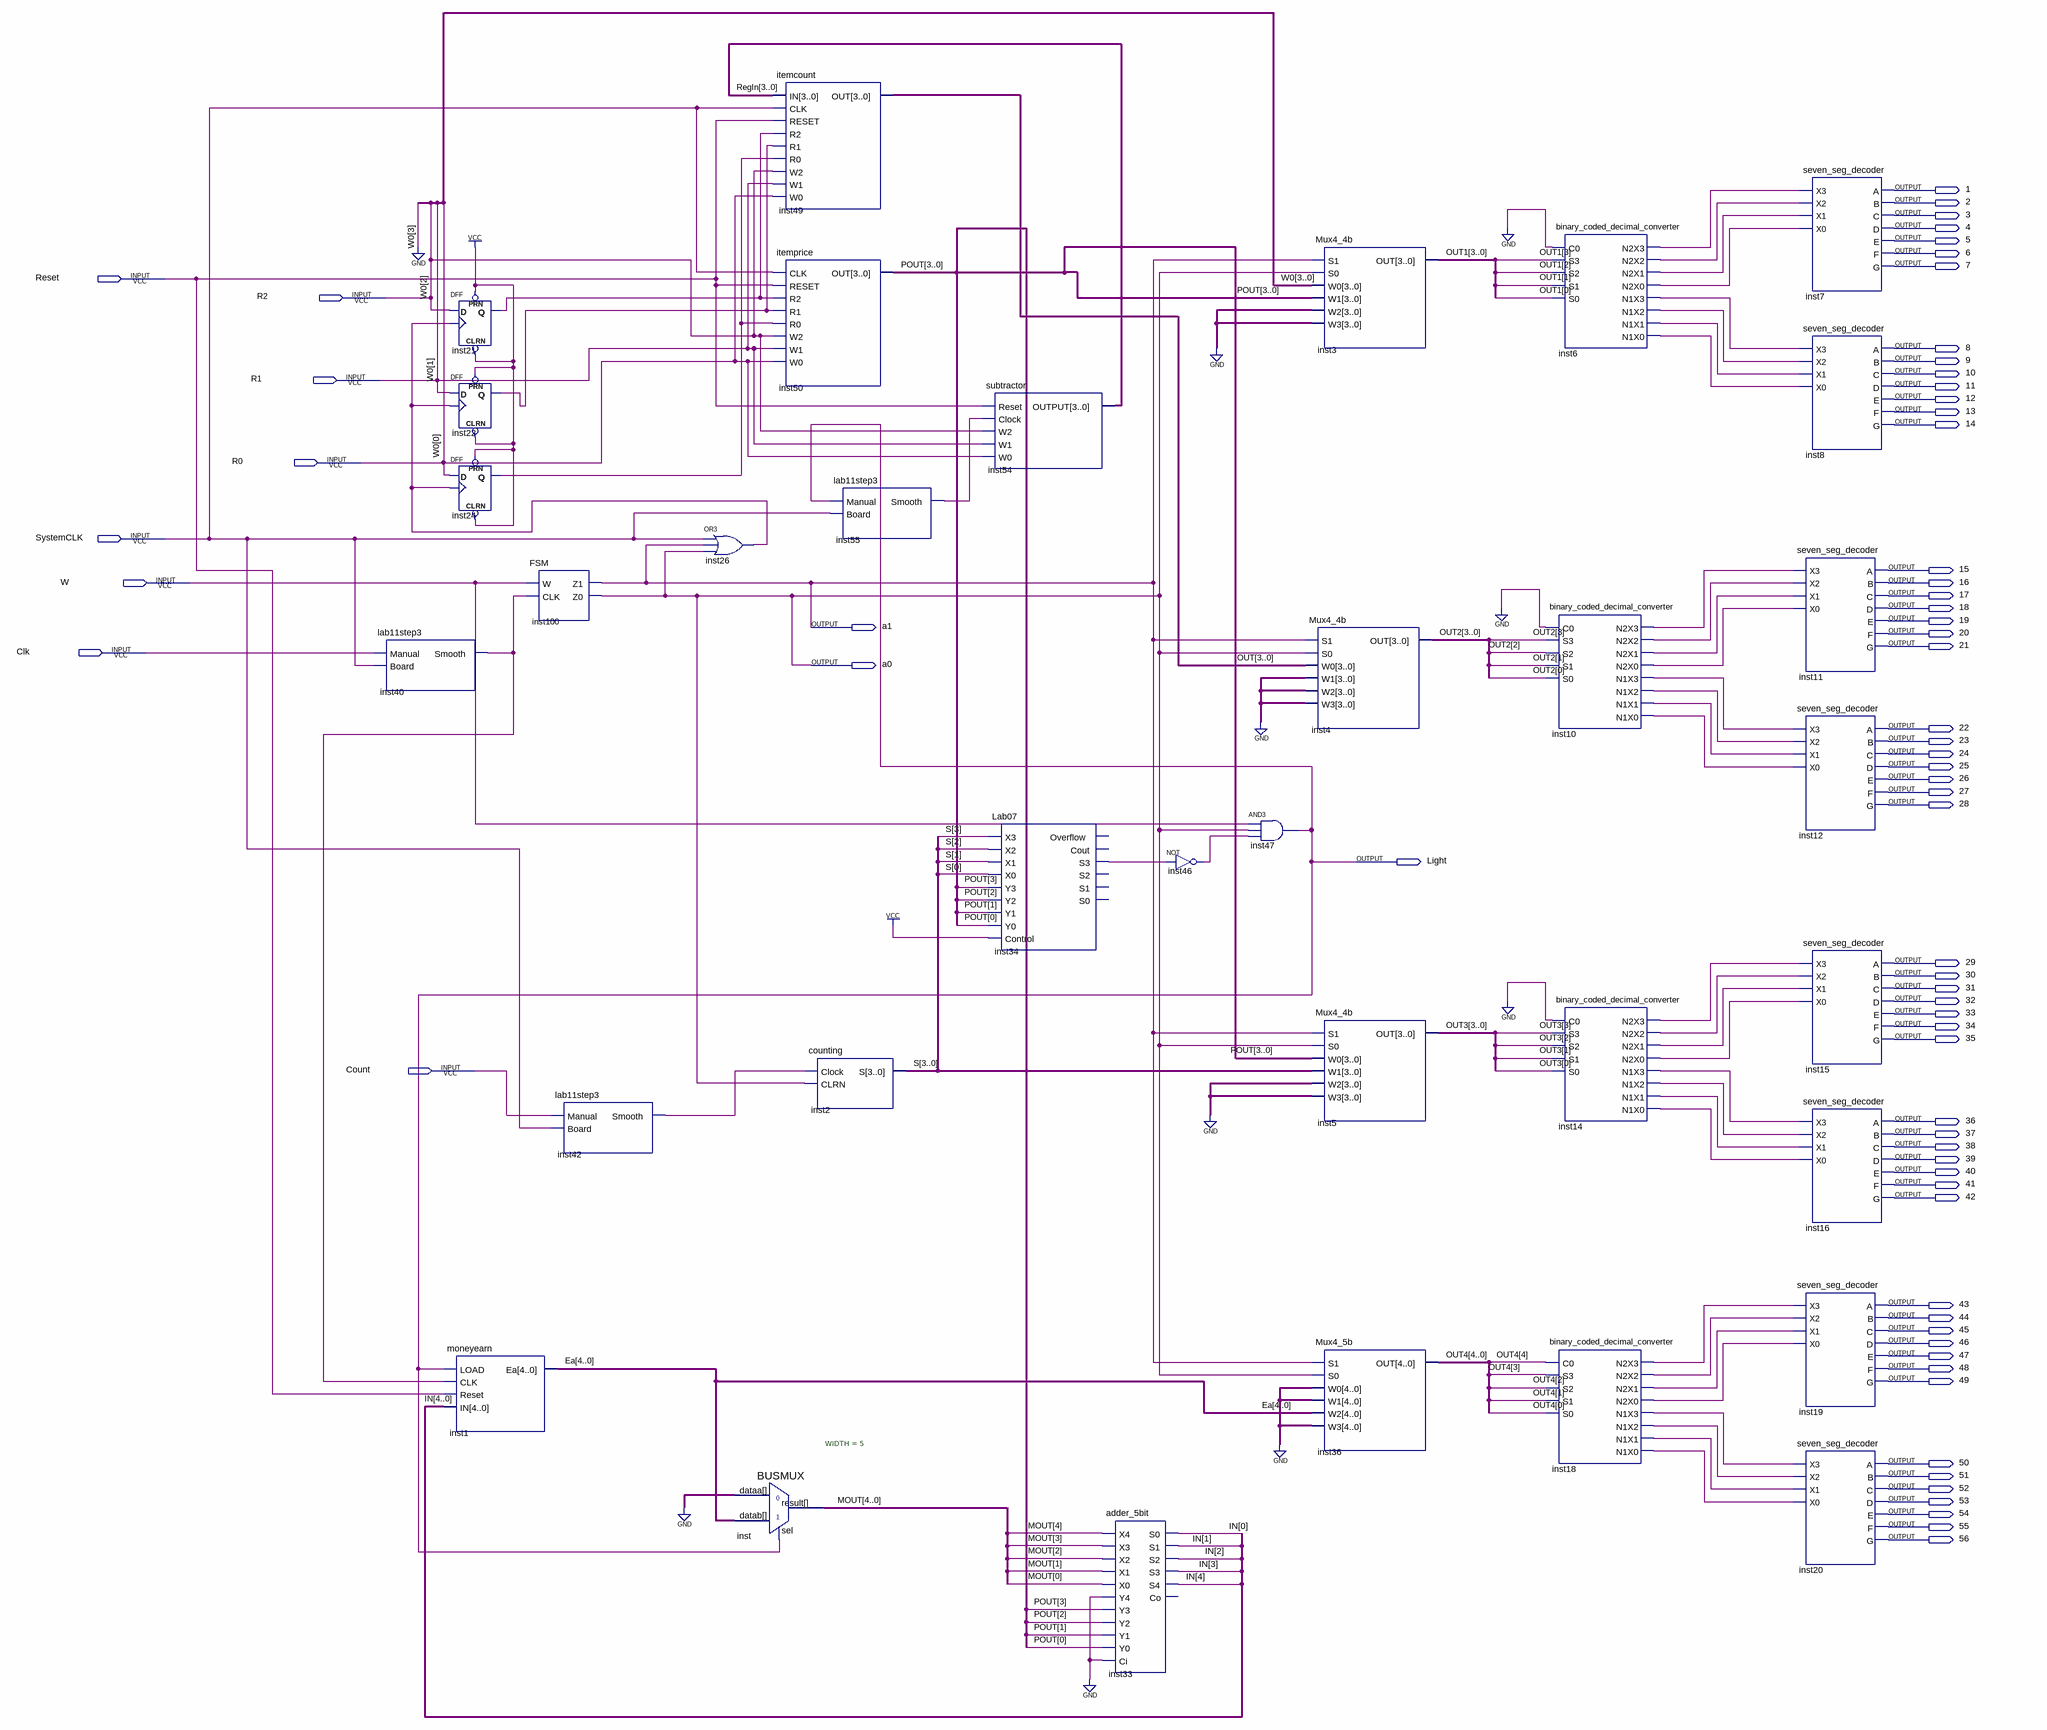
[diagram p0: schematic sheet]
// Quartus schematic Finalproject.bdf as structural Verilog: 34 symbols, 67 pins
module Finalproject (
  input  Reset,
  input  R2,
  input  R1,
  input  R0,
  input  SystemCLK,
  input  W,
  input  Clk,
  input  Count,
  output \1 ,
  output \2 ,
  output \3 ,
  output \4 ,
  output \5 ,
  output \6 ,
  output \7 ,
  output \8 ,
  output \9 ,
  output \10 ,
  output \11 ,
  output \12 ,
  output \13 ,
  output \14 ,
  output \15 ,
  output \16 ,
  output \17 ,
  output \18 ,
  output \19 ,
  output a1,
  output \20 ,
  output \21 ,
  output a0,
  output \22 ,
  output \23 ,
  output \24 ,
  output \25 ,
  output \26 ,
  output \27 ,
  output \28 ,
  output Light,
  output \29 ,
  output \30 ,
  output \31 ,
  output \32 ,
  output \33 ,
  output \34 ,
  output \35 ,
  output \36 ,
  output \37 ,
  output \38 ,
  output \39 ,
  output \40 ,
  output \41 ,
  output \42 ,
  output \43 ,
  output \44 ,
  output \45 ,
  output \46 ,
  output \47 ,
  output \48 ,
  output \49 ,
  output \50 ,
  output \51 ,
  output \52 ,
  output \53 ,
  output \54 ,
  output \55 ,
  output \56 
);

  wire inst6_n1x0, inst6_n1x1, inst6_n1x2, inst6_n1x3, inst6_n2x0, inst6_n2x1, inst6_n2x2, inst6_n2x3,
       inst10_n1x0, inst10_n1x1, inst10_n1x2, inst10_n1x3, inst10_n2x0, inst10_n2x1, inst10_n2x2,
       inst10_n2x3, inst14_n1x0, inst14_n1x1, inst14_n1x2, inst14_n1x3, inst14_n2x0, inst14_n2x1,
       inst14_n2x2, inst14_n2x3, inst18_n1x0, inst18_n1x1, inst18_n1x2, inst18_n1x3, inst18_n2x0,
       inst18_n2x1, inst18_n2x2, inst18_n2x3, inst21_q, inst22_q, inst24_q, inst26_out, inst34_s3,
       inst40_smooth, inst42_smooth, inst46_out, inst55_smooth;
  wire [3:0] OUT, OUT1, OUT2, OUT3, POUT, RegIn, S;
  wire [4:0] Ea, IN, MOUT, OUT4;

  lab11step3 inst40 (.Manual(Clk), .Board(SystemCLK), .Smooth(inst40_smooth));
  DFF inst21 (.CLRN(1'b1), .CLK(inst26_out), .D(R2), .PRN(1'b1), .Q(inst21_q));
  DFF inst22 (.CLRN(1'b1), .CLK(inst26_out), .D(R1), .PRN(1'b1), .Q(inst22_q));
  DFF inst24 (.CLRN(1'b1), .CLK(inst26_out), .D(R0), .PRN(1'b1), .Q(inst24_q));
  moneyearn inst1 (.LOAD(Light), .CLK(inst40_smooth), .Reset(Reset), .IN(IN), .Ea(Ea));
  FSM inst100 (.W(W), .CLK(inst40_smooth), .Z1(a1), .Z0(a0));
  lab11step3 inst42 (.Manual(Count), .Board(SystemCLK), .Smooth(inst42_smooth));
  or inst26 (inst26_out, SystemCLK, a1, a0);
  BUSMUX #(.WIDTH(5)) inst (.datab(Ea), .sel(Light), .dataa({5{1'b0}}), .result(MOUT));
  itemcount inst49 (
    .IN(RegIn), .CLK(SystemCLK), .RESET(Reset), .R2(inst21_q), .R1(inst22_q), .R0(inst24_q), .W2(R2),
    .W1(R1), .W0(R0), .OUT(OUT));
  itemprice inst50 (
    .CLK(SystemCLK), .RESET(Reset), .R2(inst21_q), .R1(inst22_q), .R0(inst24_q), .W2(R2), .W1(R1), .W0(R0),
    .OUT(POUT));
  counting inst2 (.Clock(inst42_smooth), .CLRN(a0), .S(S));
  lab11step3 inst55 (.Manual(Light), .Board(SystemCLK), .Smooth(inst55_smooth));
  subtractor inst54 (.Reset(Reset), .Clock(inst55_smooth), .W2(R2), .W1(R1), .W0(R0), .OUTPUT(RegIn));
  Lab07 inst34 (
    .X3(S[3]), .X2(S[2]), .X1(S[1]), .X0(S[0]), .Y3(POUT[3]), .Y2(POUT[2]), .Y1(POUT[1]), .Y0(POUT[0]),
    .Control(1'b1), .S3(inst34_s3));  // open: Overflow, Cout, S2, S1, S0
  adder_5bit inst33 (
    .X4(MOUT[4]), .X3(MOUT[3]), .X2(MOUT[2]), .X1(MOUT[1]), .X0(MOUT[0]), .Y4(1'b0), .Y3(POUT[3]),
    .Y2(POUT[2]), .Y1(POUT[1]), .Y0(POUT[0]), .Ci(1'b0), .S0(IN[0]), .S1(IN[1]), .S2(IN[2]), .S3(IN[3]),
    .S4(IN[4]));  // open: Co
  not inst46 (inst46_out, inst34_s3);
  and inst47 (Light, W, a0, inst46_out);
  Mux4_4b inst3 (.S1(a1), .S0(a0), .W0({1'b0, R2, R1, R0}), .W1(POUT), .W2(4'b0000), .W3(4'b0000), .OUT(OUT1));
  Mux4_4b inst4 (.S1(a1), .S0(a0), .W0(OUT), .W1(4'b0000), .W2(4'b0000), .W3(4'b0000), .OUT(OUT2));
  Mux4_4b inst5 (.S1(a1), .S0(a0), .W0(POUT), .W1(S), .W2(4'b0000), .W3(4'b0000), .OUT(OUT3));
  Mux4_5b inst36 (.S1(a1), .S0(a0), .W0({5{1'b0}}), .W1({5{1'b0}}), .W2(Ea), .W3({5{1'b0}}), .OUT(OUT4));
  binary_coded_decimal_converter inst6 (
    .C0(1'b0), .S3(OUT1[3]), .S2(OUT1[2]), .S1(OUT1[1]), .S0(OUT1[0]), .N2X3(inst6_n2x3), .N2X2(inst6_n2x2),
    .N2X1(inst6_n2x1), .N2X0(inst6_n2x0), .N1X3(inst6_n1x3), .N1X2(inst6_n1x2), .N1X1(inst6_n1x1),
    .N1X0(inst6_n1x0));
  binary_coded_decimal_converter inst10 (
    .C0(1'b0), .S3(OUT2[3]), .S2(OUT2[2]), .S1(OUT2[1]), .S0(OUT2[0]), .N2X3(inst10_n2x3),
    .N2X2(inst10_n2x2), .N2X1(inst10_n2x1), .N2X0(inst10_n2x0), .N1X3(inst10_n1x3), .N1X2(inst10_n1x2),
    .N1X1(inst10_n1x1), .N1X0(inst10_n1x0));
  binary_coded_decimal_converter inst14 (
    .C0(1'b0), .S3(OUT3[3]), .S2(OUT3[2]), .S1(OUT3[1]), .S0(OUT3[0]), .N2X3(inst14_n2x3),
    .N2X2(inst14_n2x2), .N2X1(inst14_n2x1), .N2X0(inst14_n2x0), .N1X3(inst14_n1x3), .N1X2(inst14_n1x2),
    .N1X1(inst14_n1x1), .N1X0(inst14_n1x0));
  binary_coded_decimal_converter inst18 (
    .C0(OUT4[4]), .S3(OUT4[3]), .S2(OUT4[2]), .S1(OUT4[1]), .S0(OUT4[0]), .N2X3(inst18_n2x3),
    .N2X2(inst18_n2x2), .N2X1(inst18_n2x1), .N2X0(inst18_n2x0), .N1X3(inst18_n1x3), .N1X2(inst18_n1x2),
    .N1X1(inst18_n1x1), .N1X0(inst18_n1x0));
  seven_seg_decoder inst7 (
    .X3(inst6_n2x3), .X2(inst6_n2x2), .X1(inst6_n2x1), .X0(inst6_n2x0), .A(\1 ), .B(\2 ), .C(\3 ), .D(\4 ),
    .E(\5 ), .F(\6 ), .G(\7 ));
  seven_seg_decoder inst8 (
    .X3(inst6_n1x3), .X2(inst6_n1x2), .X1(inst6_n1x1), .X0(inst6_n1x0), .A(\8 ), .B(\9 ), .C(\10 ), .D(\11 ),
    .E(\12 ), .F(\13 ), .G(\14 ));
  seven_seg_decoder inst11 (
    .X3(inst10_n2x3), .X2(inst10_n2x2), .X1(inst10_n2x1), .X0(inst10_n2x0), .A(\15 ), .B(\16 ), .C(\17 ),
    .D(\18 ), .E(\19 ), .F(\20 ), .G(\21 ));
  seven_seg_decoder inst12 (
    .X3(inst10_n1x3), .X2(inst10_n1x2), .X1(inst10_n1x1), .X0(inst10_n1x0), .A(\22 ), .B(\23 ), .C(\24 ),
    .D(\25 ), .E(\26 ), .F(\27 ), .G(\28 ));
  seven_seg_decoder inst15 (
    .X3(inst14_n2x3), .X2(inst14_n2x2), .X1(inst14_n2x1), .X0(inst14_n2x0), .A(\29 ), .B(\30 ), .C(\31 ),
    .D(\32 ), .E(\33 ), .F(\34 ), .G(\35 ));
  seven_seg_decoder inst16 (
    .X3(inst14_n1x3), .X2(inst14_n1x2), .X1(inst14_n1x1), .X0(inst14_n1x0), .A(\36 ), .B(\37 ), .C(\38 ),
    .D(\39 ), .E(\40 ), .F(\41 ), .G(\42 ));
  seven_seg_decoder inst19 (
    .X3(inst18_n2x3), .X2(inst18_n2x2), .X1(inst18_n2x1), .X0(inst18_n2x0), .A(\43 ), .B(\44 ), .C(\45 ),
    .D(\46 ), .E(\47 ), .F(\48 ), .G(\49 ));
  seven_seg_decoder inst20 (
    .X3(inst18_n1x3), .X2(inst18_n1x2), .X1(inst18_n1x1), .X0(inst18_n1x0), .A(\50 ), .B(\51 ), .C(\52 ),
    .D(\53 ), .E(\54 ), .F(\55 ), .G(\56 ));

  // Other names for the same wires on the sheet: W0[2:0] = {R2, R1, R0}
endmodule
